# Altium project STM32F207VC.PrjPCB
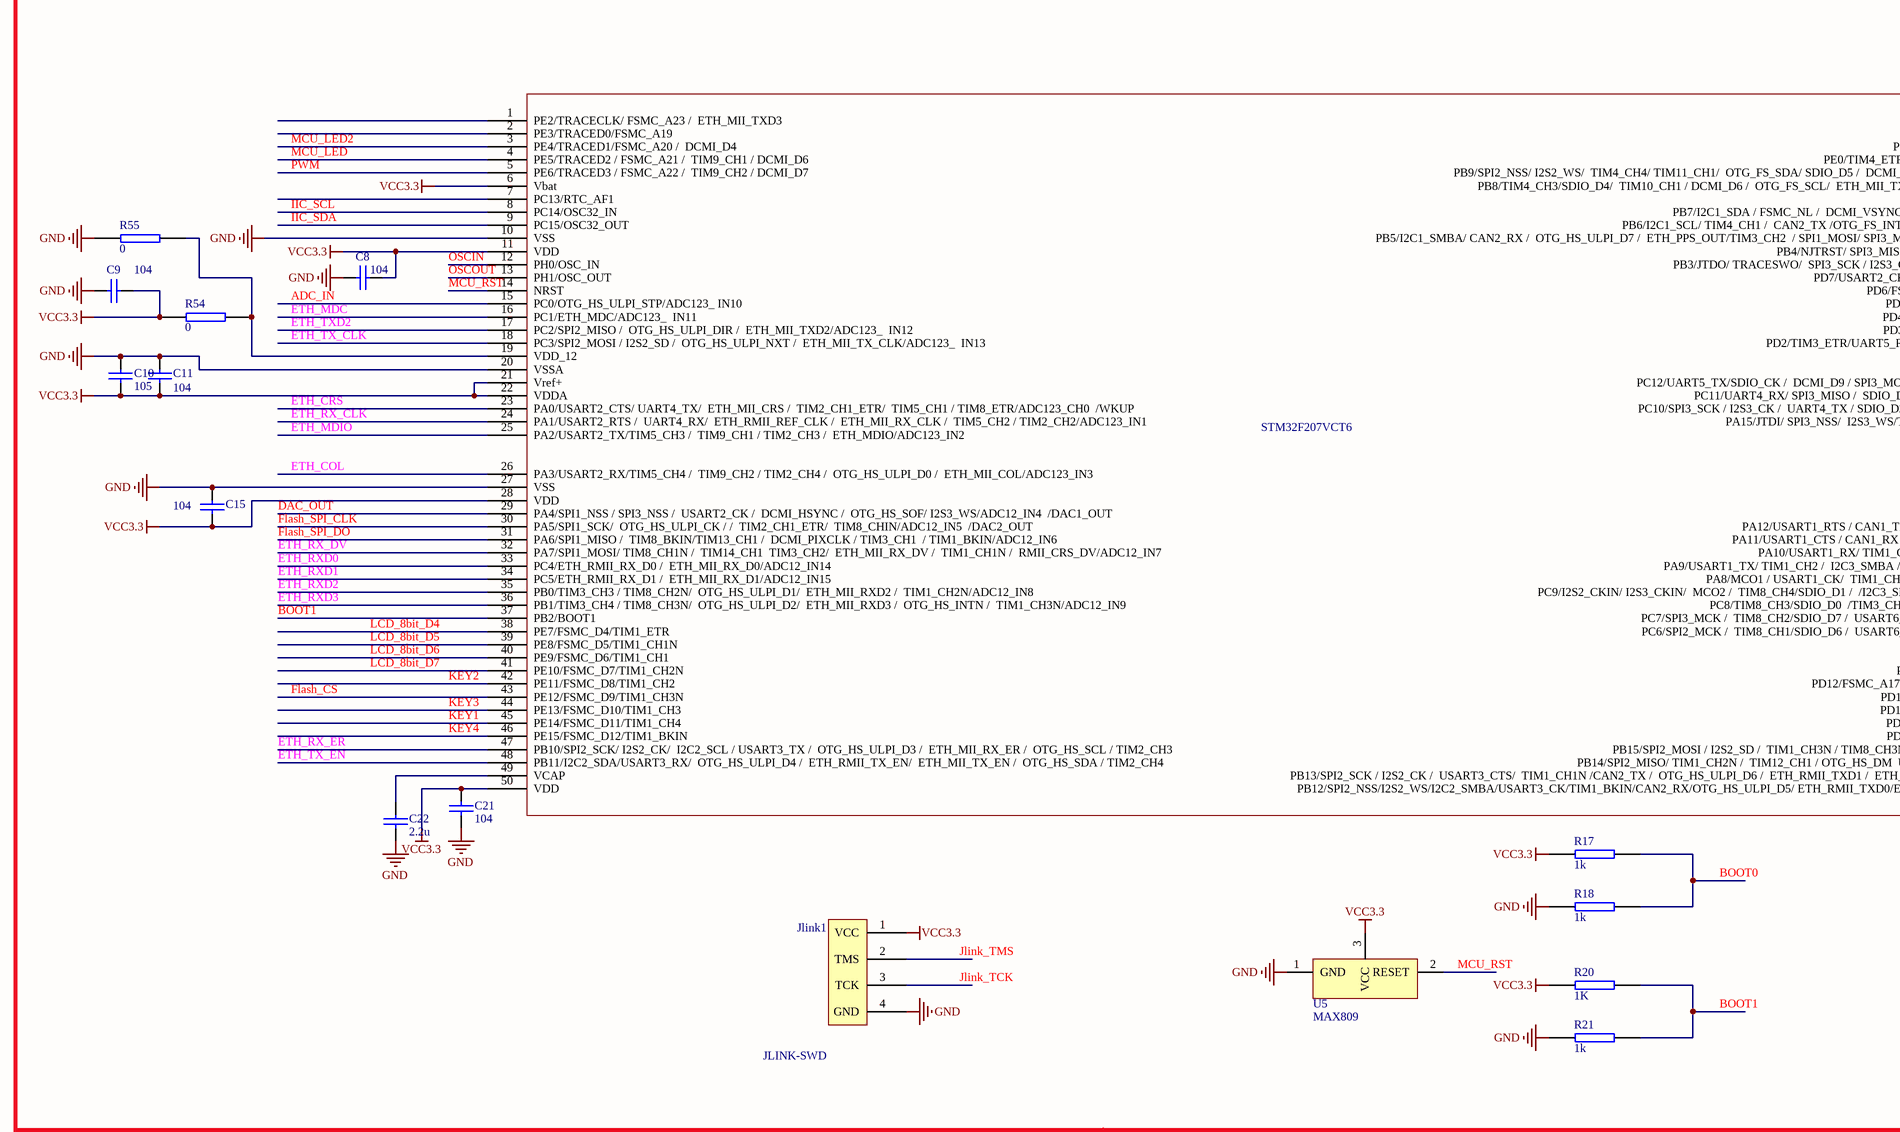
[diagram p0: STM32F207VC.SchDoc, top left]
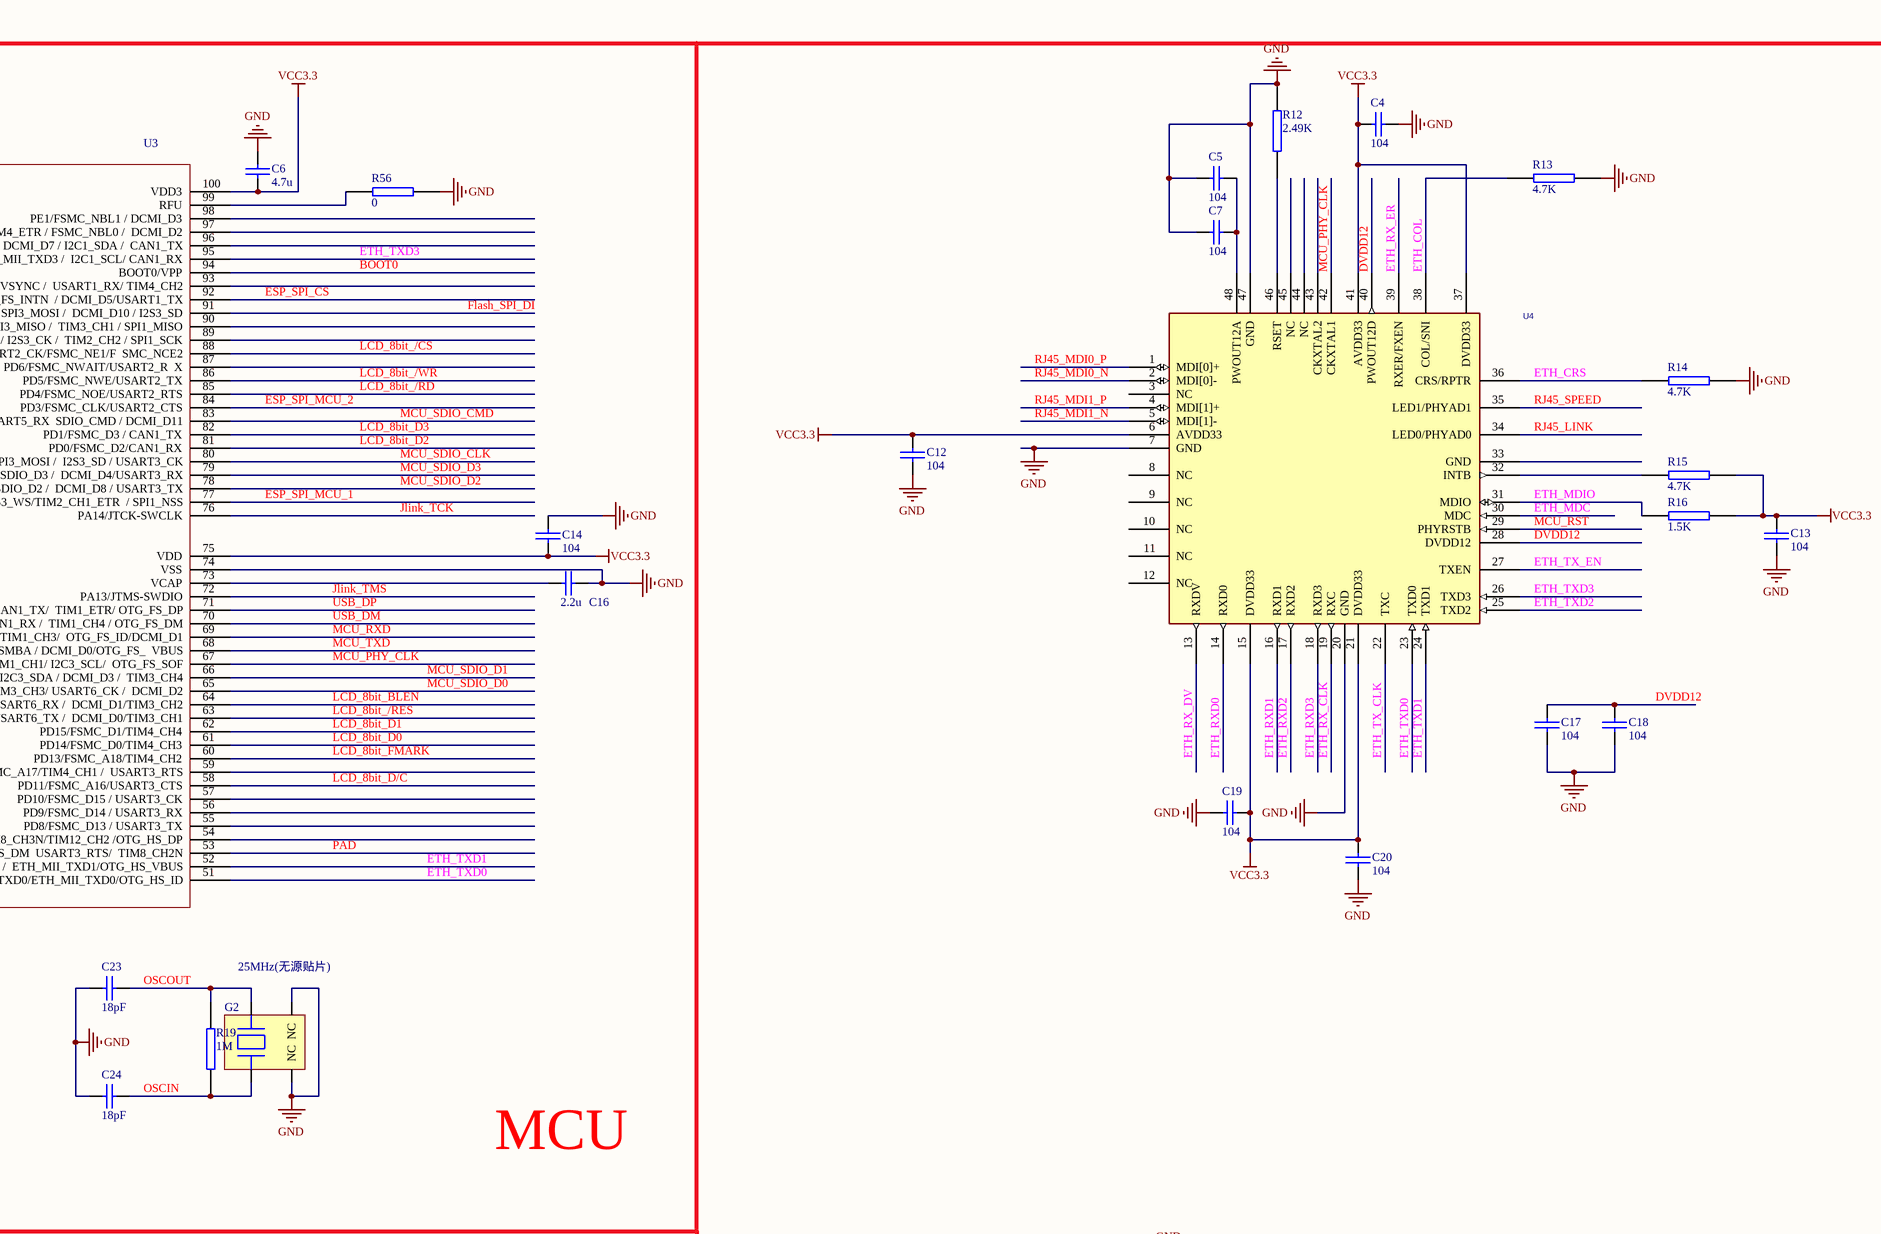
[diagram p1: STM32F207VC.SchDoc, top middle]
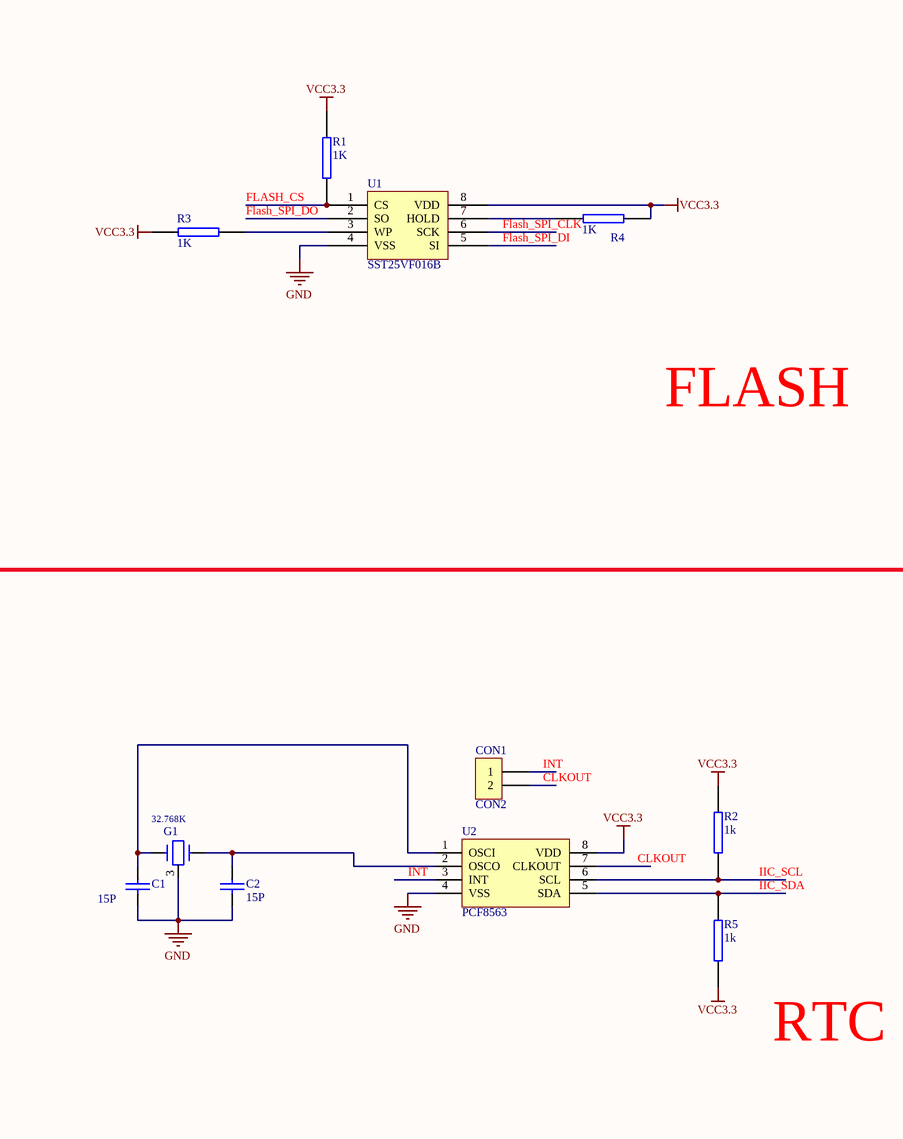
[diagram p2: STM32F207VC.SchDoc, top right]
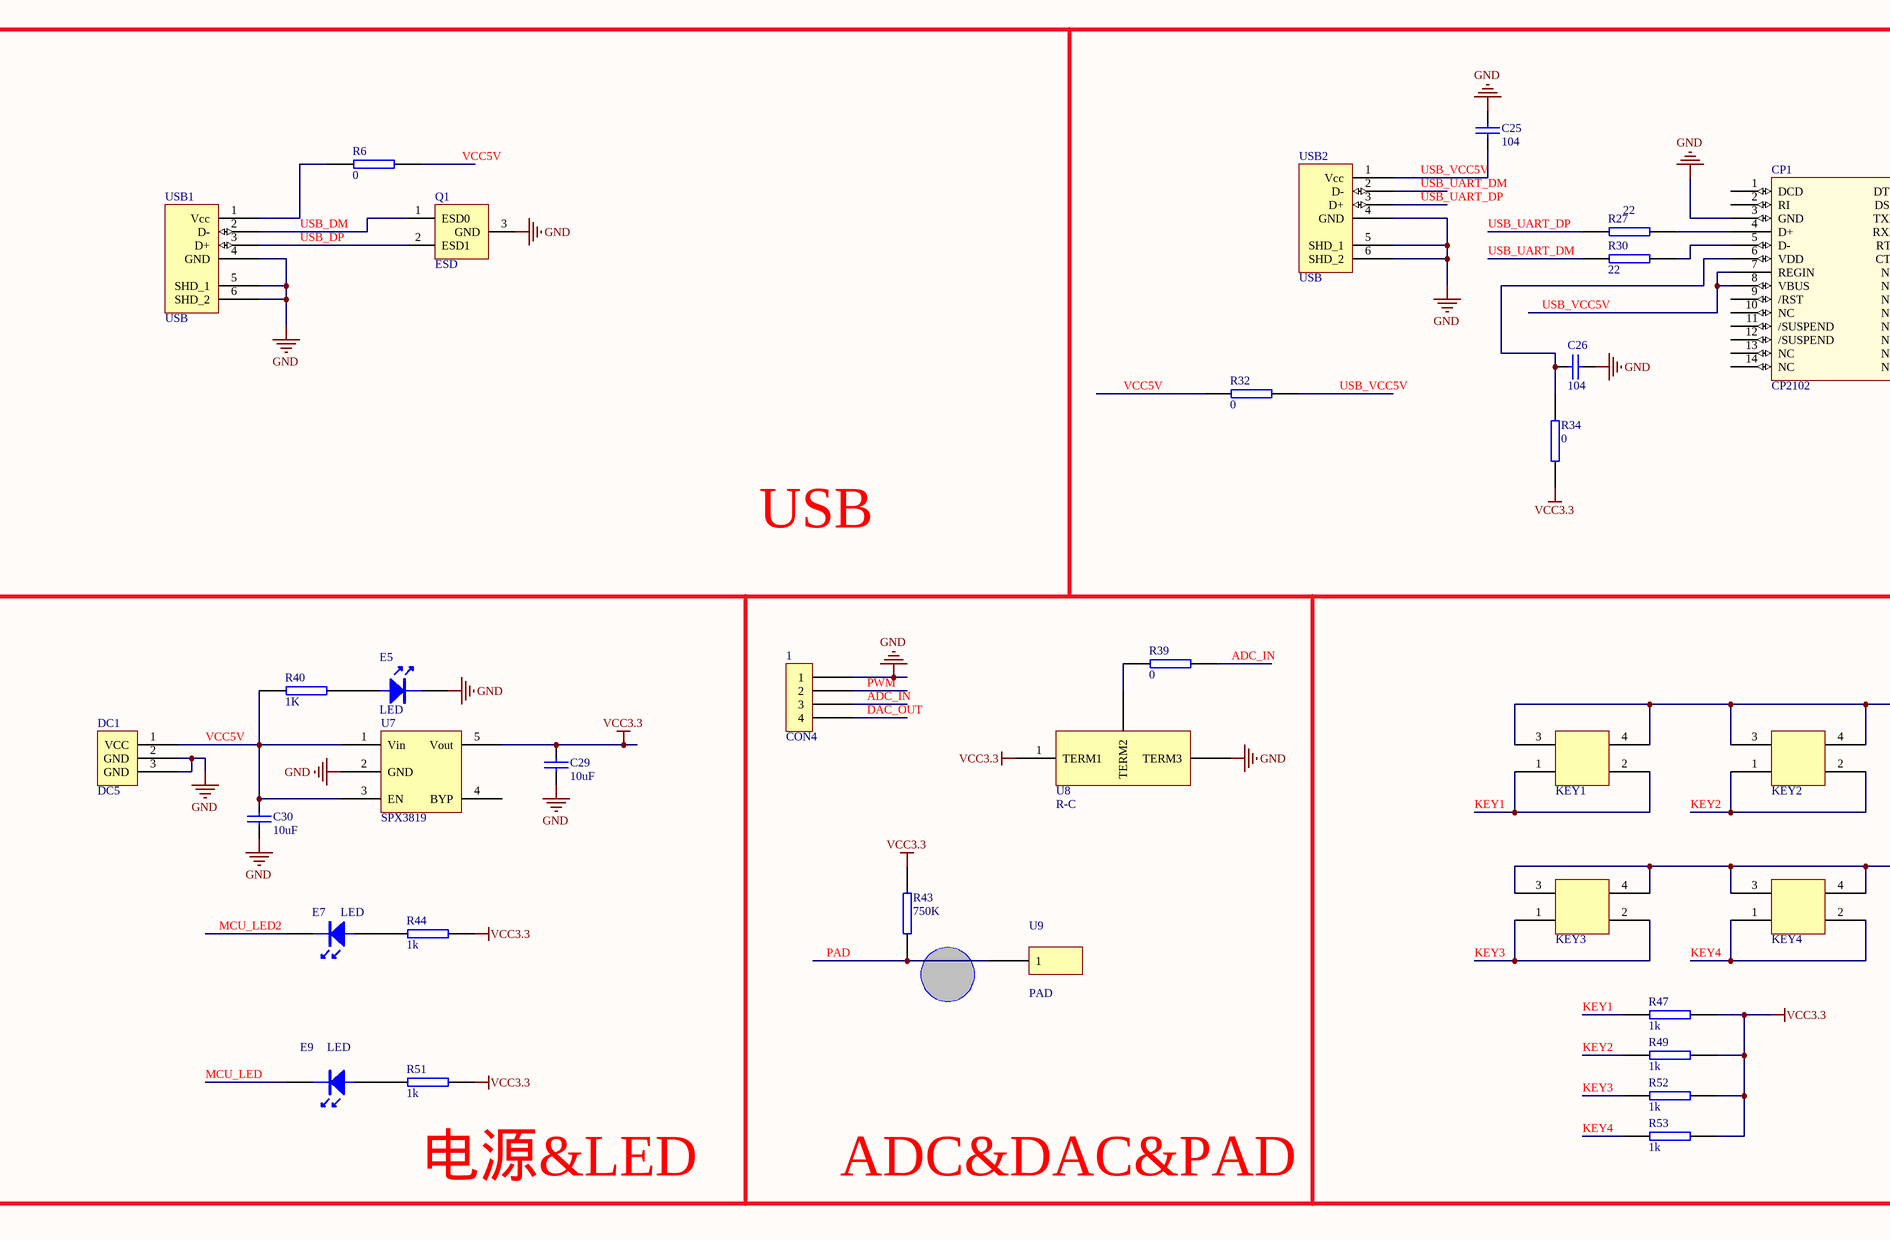
[diagram p3: STM32F207VC.SchDoc, bottom left]
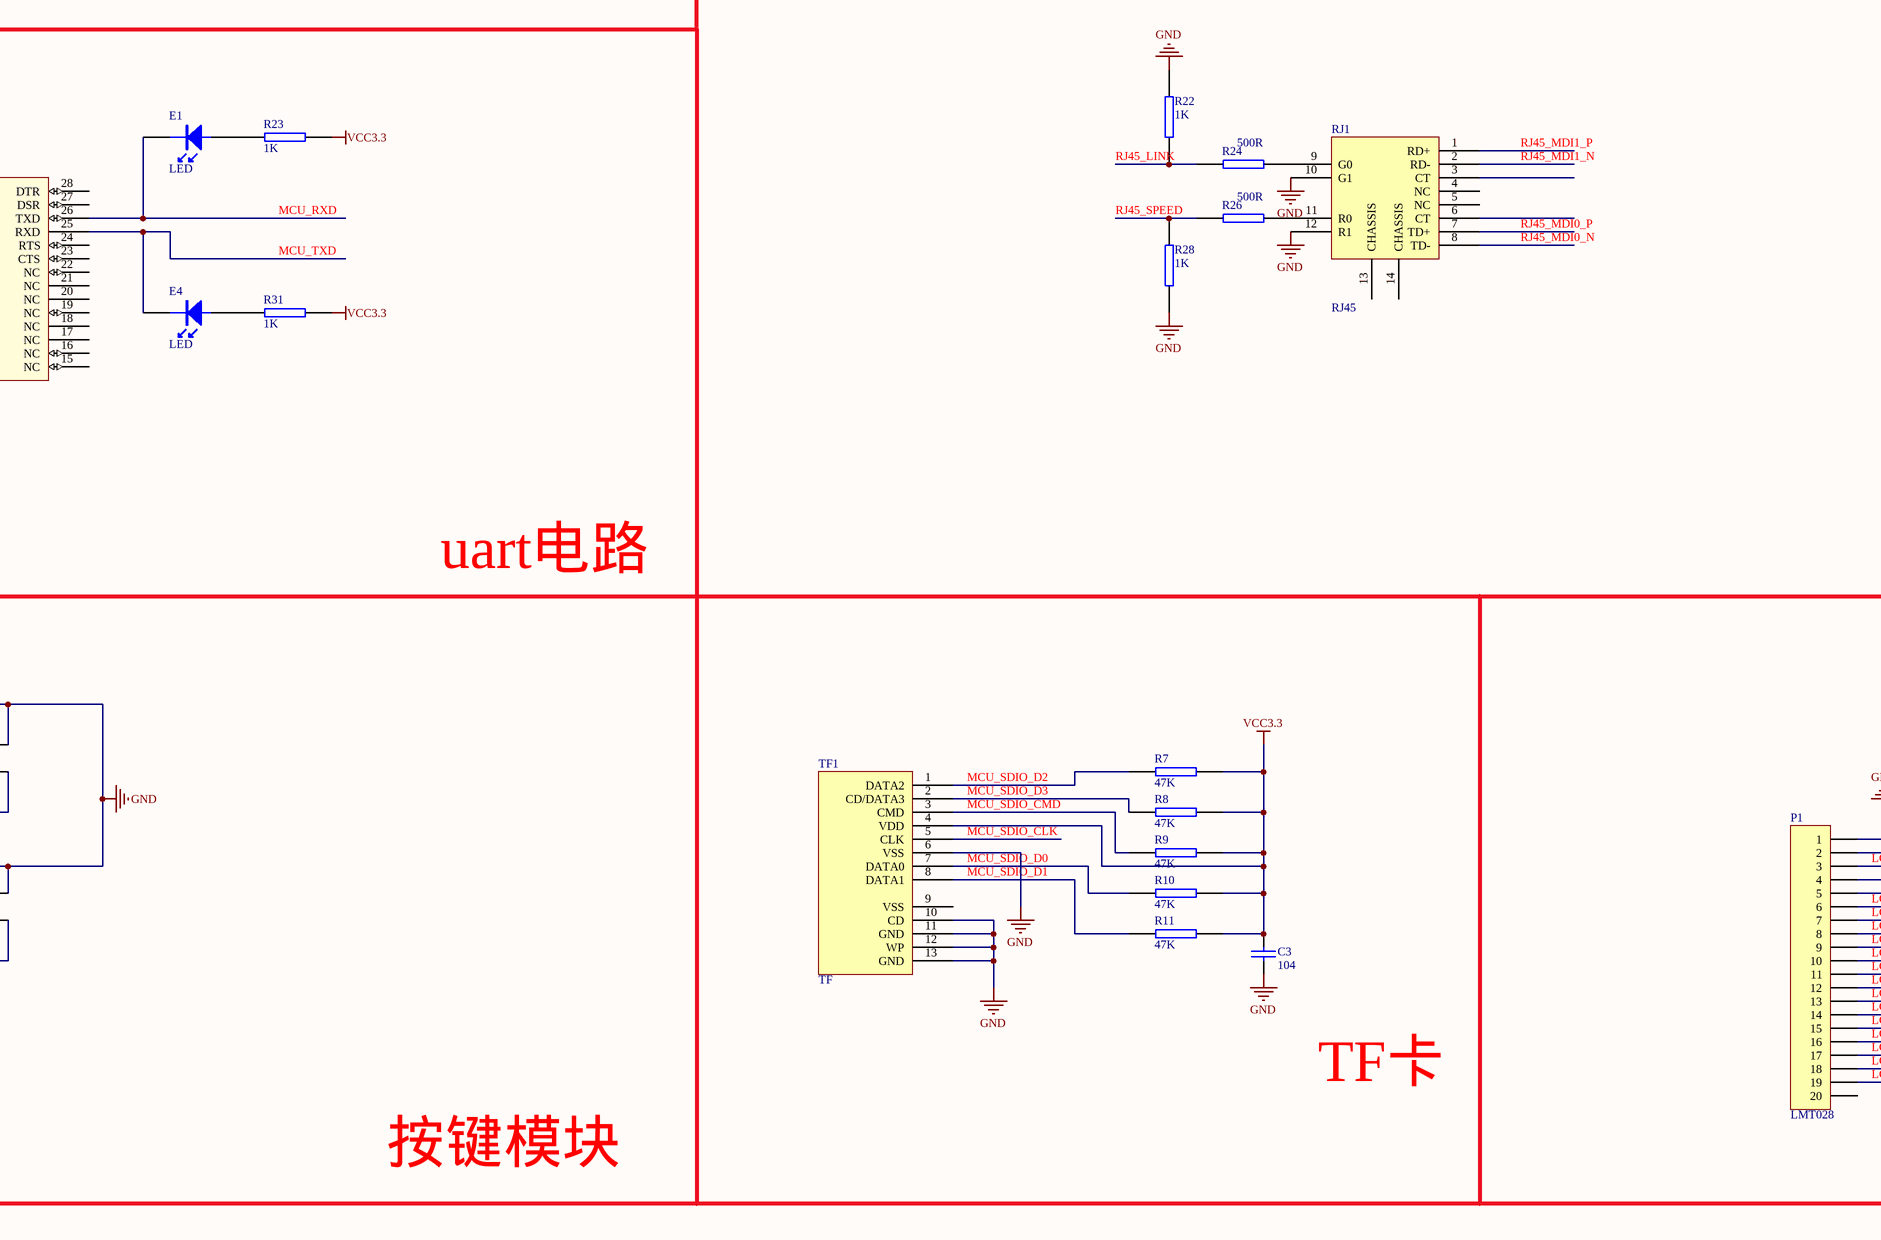
[diagram p4: STM32F207VC.SchDoc, bottom middle]
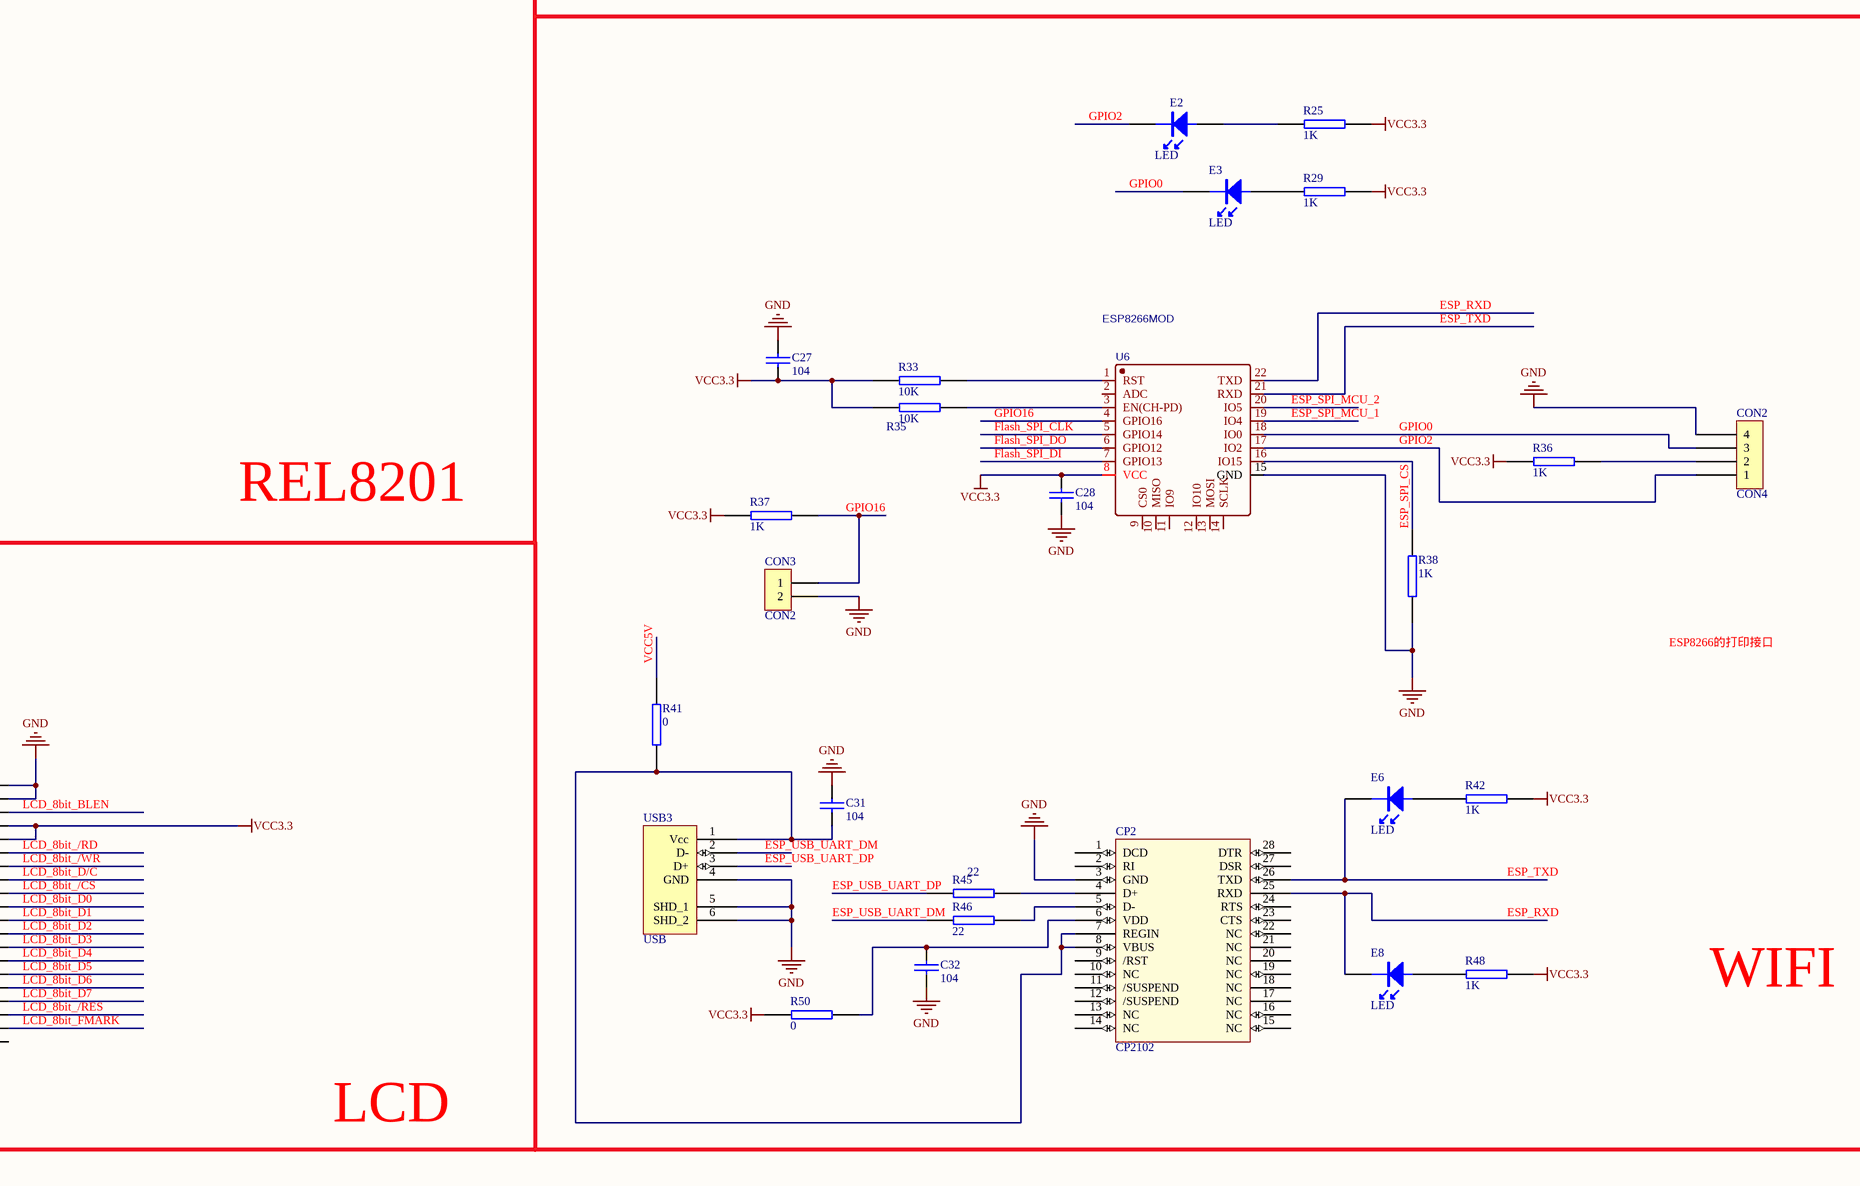
[diagram p5: STM32F207VC.SchDoc, bottom right]
1 sheet, 127 parts. Net scope: global (net labels, ports and power ports of the same name join across sheets).
Board file: STM32F207VC.PcbDoc

## Sheet STM32F207VC.SchDoc
size A0

### Parts
1  CON4  [4 pin]
C1  15P  [0603]
C2  15P  [0603]
C3  104  [0603]
C4  104  [0603]
C5  104  [0603]
C6  4.7u  [0603]
C7  104  [0603]
C8  104  [0603]
C9  104  [0603]
C10  105  [0603]
C11  104  [0603]
C12  104  [0603]
C13  104  [0603]
C14  104  [0603]
C15  104  [0603]
C16  2.2u  [0603]
C17  104  [0603]
C18  104  [0603]
C19  104  [0603]
C20  104  [0603]
C21  104  [0603]
C22  2.2u  [0603]
C23  18pF  [0603]
C24  18pF  [0603]
C25  104  [0603]
C26  104  [0603]
C27  104  [0603]
C28  104  [0603]
C29  10uF  [0603]
C30  10uF  [0603]
C31  104  [0603]
C32  104  [0603]
CON1  CON2  [2pin]
CON2  CON4  [4 pin]
CON3  CON2  [2pin]
CP1  CP2102  [QFN28]
CP2  CP2102  [QFN28]
DC1  DC5  [DC5]
E1  LED  [LED_0603L]
E2  LED  [LED_0603L]
E3  LED  [LED_0603L]
E4  LED  [LED_0603L]
E5  LED  [LED_0603L]
E6  LED  [LED_0603L]
E7  LED  [LED_0603L]
E8  LED  [LED_0603L]
E9  LED  [LED_0603L]
G1  32.768K  [XTAL3X8]
G2  25MHz(无源贴片)  [G3225]
Jlink1  JLINK-SWD  [Jlink-SWD]
KEY1  KEY  [KEY]  (value not drawn)
KEY2  KEY  [KEY]  (value not drawn)
KEY3  KEY  [KEY]  (value not drawn)
KEY4  KEY  [KEY]  (value not drawn)
P1  LMT028  [2.0 pin]
Q1  ESD  [SOT32-809]
R1  1K  [0603]
R2  1k  [0603]
R3  1K  [0603]
R4  1K  [0603]
R5  1k  [0603]
R6  0  [0603]
R7  47K  [0603]
R8  47K  [0603]
R9  47K  [0603]
R10  47K  [0603]
R11  47K  [0603]
R12  2.49K  [0603]
R13  4.7K  [0603]
R14  4.7K  [0603]
R15  4.7K  [0603]
R16  1.5K  [0603]
R17  1k  [0603]
R18  1k  [0603]
R19  1M  [0603]
R20  1K  [0603]
R21  1k  [0603]
R22  1K  [0603]
R23  1K  [0603]
R24  500R  [0603]
R25  1K  [0603]
R26  500R  [0603]
R27  22  [0603]
R28  1K  [0603]
R29  1K  [0603]
R30  22  [0603]
R31  1K  [0603]
R32  0  [0603]
R33  10K  [0603]
R34  0  [0603]
R35  10K  [0603]
R36  1K  [0603]
R37  1K  [0603]
R38  1K  [0603]
R39  0  [0603]
R40  1K  [0603]
R41  0  [0603]
R42  1K  [0603]
R43  750K  [0603]
R44  1k  [0603]
R45  22  [0603]
R46  22  [0603]
R47  1k  [0603]
R48  1K  [0603]
R49  1k  [0603]
R50  0  [0603]
R51  1k  [0603]
R52  1k  [0603]
R53  1k  [0603]
R54  0  [0603]
R55  0  [0603]
R56  0  [0603]
RJ1  RJ45  [RJ45]
TF1  TF  [TF]
U1  SST25VF016B  [SOW8]
U2  PCF8563  [SO8]
U3  STM32F207VCT6  [LQFP-100]
U4  RTL8201EL  [RTL8201EL-LQFP48]  (value not drawn)
U5  MAX809  [SOT32-809]
U6  ESP8266MOD  [ESP8266MOD]
U7  SPX3819  [SOT-23-5]
U8  R-C  [R-Change]
U9  PAD  [PAD]
USB1  USB  [USB-TA]
USB2  USB  [USB-TB]
USB3  USB  [USB-TB]

### Nets
GND: 1.1 C1.2 C2.2 C3.2 C4.2 C5.1 C6.2 C7.1 C8.1 C9.1 C10.2 C11.2 C12.1 C13.1 C14.2 C15.2 C16.1 C17.1 C18.1 C19.2 C20.1 C21.2 C22.1 C23.1 C24.1 C25.1 C26.2 C27.1 C28.2 C29.2 C30.2 C31.1 C32.2 CON2.4 CON3.2 CP1.3(GND) CP2.3(GND) DC1.2(GND) DC1.3(GND) E5.2 G1.3 G2.2(NC) G2.4(NC) Jlink1.4(GND) KEY1.3 KEY1.4 KEY2.3 KEY2.4 KEY3.3 KEY3.4 KEY4.3 KEY4.4 P1.1 P1.2 Q1.3(GND) R12.1 R13.1 R14.1 R18.1 R21.1 R22.2 R28.1 R38.2 R55.1 R56.2 RJ1.10(G1) RJ1.12(R1) TF1.6(VSS) TF1.10(CD) TF1.11(GND) TF1.12(WP) TF1.13(GND) U1.4(VSS) U2.4(VSS) U3.10(VSS) U3.20(VSSA) U3.27(VSS) U3.74(VSS) U4.7(GND) U4.20(GND) U4.47(GND) U5.1(GND) U6.15(GND) U7.2(GND) U8.3(TERM3) USB1.4(GND) USB1.5(SHD_1) USB1.6(SHD_2) USB2.4(GND) USB2.5(SHD_1) USB2.6(SHD_2) USB3.4(GND) USB3.5(SHD_1) USB3.6(SHD_2)
VCC3.3: C3.1 C4.1 C6.1 C8.2 C9.2 C10.1 C11.1 C12.2 C13.2 C14.1 C15.1 C19.1 C20.2 C21.1 C27.2 C28.1 C29.1 Jlink1.1(VCC) P1.4 P1.5 R1.2 R2.2 R3.1 R4.2 R5.1 R7.2 R8.2 R9.2 R10.2 R11.2 R15.1 R16.1 R17.1 R20.1 R23.2 R25.2 R29.2 R31.2 R33.1 R34.1 R35.1 R36.1 R37.2 R42.2 R43.2 R44.2 R47.2 R48.2 R49.2 R50.2 R51.2 R52.2 R53.2 R54.1 TF1.4(VDD) U1.8(VDD) U2.8(VDD) U3.6(Vbat) U3.11(VDD) U3.21(Vref+) U3.22(VDDA) U3.28(VDD) U3.50(VDD) U3.75(VDD) U3.100(VDD3) U4.6(AVDD33) U4.15(DVDD33) U4.21(DVDD33) U4.37(DVDD33) U4.41(AVDD33) U5.3(VCC) U6.8(VCC) U7.5(Vout) U8.1(TERM1)
ADC_IN: 1.3 R39.2 U3.15(PC0/OTG_HS_ULPI_STP/ADC123__IN10)
BOOT0: R17.2 R18.2 U3.94(BOOT0/VPP)
BOOT1: R20.2 R21.2 U3.37(PB2/BOOT1)
CLKOUT: CON1.2 U2.7(CLKOUT)
DAC_OUT: 1.4 U3.29(PA4/SPI1_NSS_/_SPI3_NSS_/__USART2_CK_/__DCMI_HSYNC_/__OTG_HS_SOF/_I2S3_WS/ADC12_IN4__/DAC1_OUT)
DVDD12: C17.2 C18.2 U4.28(DVDD12) U4.40(PWOUT12D)
ESP_RXD: CP2.25(RXD) E8.2 U6.22(TXD)
ESP_SPI_CS: R38.1 U3.92(PB6/I2C1_SCL/_TIM4_CH1_/__CAN2_TX_/OTG_FS_INTN__/_DCMI_D5/USART1_TX) U6.16(IO15)
ESP_SPI_MCU_1: U3.77(PA15/JTDI/_SPI3_NSS/__I2S3_WS/TIM2_CH1_ETR__/_SPI1_NSS) U6.19(IO4)
ESP_SPI_MCU_2: U3.84(PD3/FSMC_CLK/USART2_CTS) U6.20(IO5)
ESP_TXD: CP2.26(TXD) E6.2 U6.21(RXD)
ESP_USB_UART_DM: R46.1 USB3.2(D-)
ESP_USB_UART_DP: R45.1 USB3.3(D+)
ETH_COL: R13.2 U3.26(PA3/USART2_RX/TIM5_CH4_/__TIM9_CH2_/_TIM2_CH4_/__OTG_HS_ULPI_D0_/__ETH_MII_COL/ADC123_IN3) U4.38(COL/SNI)
ETH_CRS: R14.2 U3.23(PA0/USART2_CTS/_UART4_TX/__ETH_MII_CRS_/__TIM2_CH1_ETR/__TIM5_CH1_/_TIM8_ETR/ADC123_CH0__/WKUP) U4.36(CRS/RPTR)
ETH_MDC: U3.16(PC1/ETH_MDC/ADC123___IN11) U4.30(MDC)
ETH_MDIO: R16.2 U3.25(PA2/USART2_TX/TIM5_CH3_/__TIM9_CH1_/_TIM2_CH3_/__ETH_MDIO/ADC123_IN2) U4.31(MDIO)
ETH_RX_CLK: U3.24(PA1/USART2_RTS_/__UART4_RX/__ETH_RMII_REF_CLK_/__ETH_MII_RX_CLK_/__TIM5_CH2_/_TIM2_CH2/ADC123_IN1) U4.19(RXC)
ETH_RX_DV: U3.32(PA7/SPI1_MOSI/_TIM8_CH1N_/__TIM14_CH1__TIM3_CH2/__ETH_MII_RX_DV_/__TIM1_CH1N_/__RMII_CRS_DV/ADC12_IN7) U4.13(RXDV)
ETH_RX_ER: U3.47(PB10/SPI2_SCK/_I2S2_CK/__I2C2_SCL_/_USART3_TX_/__OTG_HS_ULPI_D3_/__ETH_MII_RX_ER_/__OTG_HS_SCL_/_TIM2_CH3) U4.39(RXER/FXEN)
ETH_RXD0: U3.33(PC4/ETH_RMII_RX_D0_/__ETH_MII_RX_D0/ADC12_IN14) U4.14(RXD0)
ETH_RXD1: U3.34(PC5/ETH_RMII_RX_D1_/__ETH_MII_RX_D1/ADC12_IN15) U4.16(RXD1)
ETH_RXD2: U3.35(PB0/TIM3_CH3_/_TIM8_CH2N/__OTG_HS_ULPI_D1/__ETH_MII_RXD2_/__TIM1_CH2N/ADC12_IN8) U4.17(RXD2)
ETH_RXD3: U3.36(PB1/TIM3_CH4_/_TIM8_CH3N/__OTG_HS_ULPI_D2/__ETH_MII_RXD3_/__OTG_HS_INTN_/__TIM1_CH3N/ADC12_IN9) U4.18(RXD3)
ETH_TX_CLK: U3.18(PC3/SPI2_MOSI_/_I2S2_SD_/__OTG_HS_ULPI_NXT_/__ETH_MII_TX_CLK/ADC123___IN13) U4.22(TXC)
ETH_TX_EN: U3.48(PB11/I2C2_SDA/USART3_RX/__OTG_HS_ULPI_D4_/__ETH_RMII_TX_EN/__ETH_MII_TX_EN_/__OTG_HS_SDA_/_TIM2_CH4) U4.27(TXEN)
ETH_TXD0: U3.51(PB12/SPI2_NSS/I2S2_WS/I2C2_SMBA/USART3_CK/TIM1_BKIN/CAN2_RX/OTG_HS_ULPI_D5/_ETH_RMII_TXD0/ETH_MII_TXD0/OTG_HS_ID) U4.23(TXD0)
ETH_TXD1: U3.52(PB13/SPI2_SCK_/_I2S2_CK_/__USART3_CTS/__TIM1_CH1N_/CAN2_TX_/__OTG_HS_ULPI_D6_/__ETH_RMII_TXD1_/__ETH_MII_TXD1/OTG_HS_VBUS) U4.24(TXD1)
ETH_TXD2: U3.17(PC2/SPI2_MISO_/__OTG_HS_ULPI_DIR_/__ETH_MII_TXD2/ADC123___IN12) U4.25(TXD2)
ETH_TXD3: U3.95(PB8/TIM4_CH3/SDIO_D4/__TIM10_CH1_/_DCMI_D6_/__OTG_FS_SCL/__ETH_MII_TXD3_/__I2C1_SCL/_CAN1_RX) U4.26(TXD3)
Flash_CS: R1.1 U1.1(CS) U3.43(PE12/FSMC_D9/TIM1_CH3N)
Flash_SPI_CLK: U1.6(SCK) U3.30(PA5/SPI1_SCK/__OTG_HS_ULPI_CK_/_/__TIM2_CH1_ETR/__TIM8_CHIN/ADC12_IN5__/DAC2_OUT) U6.5(GPIO14)
Flash_SPI_DI: U1.5(SI) U3.91(PB5/I2C1_SMBA/_CAN2_RX_/__OTG_HS_ULPI_D7_/__ETH_PPS_OUT/TIM3_CH2__/_SPI1_MOSI/_SPI3_MOSI_/__DCMI_D10_/_I2S3_SD) U6.7(GPIO13)
Flash_SPI_DO: U1.2(SO) U3.31(PA6/SPI1_MISO_/__TIM8_BKIN/TIM13_CH1_/__DCMI_PIXCLK_/_TIM3_CH1__/_TIM1_BKIN/ADC12_IN6) U6.6(GPIO12)
GPIO0: CON2.3 E3.2 U6.18(IO0)
GPIO2: CON2.1 E2.2 U6.17(IO2)
GPIO16: CON3.1 R37.1 U6.4(GPIO16)
IIC_SCL: R2.1 U2.6(SCL) U3.8(PC14/OSC32_IN)
IIC_SDA: R5.2 U2.5(SDA) U3.9(PC15/OSC32_OUT)
INT: CON1.1 U2.3(INT)
Jlink_TCK: Jlink1.3(TCK) U3.76(PA14/JTCK-SWCLK)
Jlink_TMS: Jlink1.2(TMS) U3.72(PA13/JTMS-SWDIO)
KEY1: KEY1.1 KEY1.2 R47.1 U3.45(PE14/FSMC_D11/TIM1_CH4)
KEY2: KEY2.1 KEY2.2 R49.1 U3.42(PE11/FSMC_D8/TIM1_CH2)
KEY3: KEY3.1 KEY3.2 R52.1 U3.44(PE13/FSMC_D10/TIM1_CH3)
KEY4: KEY4.1 KEY4.2 R53.1 U3.46(PE15/FSMC_D12/TIM1_BKIN)
LCD_8bit_/CS: P1.9 U3.88(PD7/USART2_CK/FSMC_NE1/F__SMC_NCE2)
LCD_8bit_/RD: P1.6 U3.85(PD4/FSMC_NOE/USART2_RTS)
LCD_8bit_/RES: P1.18 U3.63(PC6/SPI2_MCK_/__TIM8_CH1/SDIO_D6_/__USART6_TX_/__DCMI_D0/TIM3_CH1)
LCD_8bit_/WR: P1.7 U3.86(PD5/FSMC_NWE/USART2_TX)
LCD_8bit_BLEN: P1.3 U3.64(PC7/SPI3_MCK_/__TIM8_CH2/SDIO_D7_/__USART6_RX_/__DCMI_D1/TIM3_CH2)
LCD_8bit_D0: P1.10 U3.61(PD14/FSMC_D0/TIM4_CH3)
LCD_8bit_D1: P1.11 U3.62(PD15/FSMC_D1/TIM4_CH4)
LCD_8bit_D2: P1.12 U3.81(PD0/FSMC_D2/CAN1_RX)
LCD_8bit_D3: P1.13 U3.82(PD1/FSMC_D3_/_CAN1_TX)
LCD_8bit_D4: P1.14 U3.38(PE7/FSMC_D4/TIM1_ETR)
LCD_8bit_D5: P1.15 U3.39(PE8/FSMC_D5/TIM1_CH1N)
LCD_8bit_D6: P1.16 U3.40(PE9/FSMC_D6/TIM1_CH1)
LCD_8bit_D7: P1.17 U3.41(PE10/FSMC_D7/TIM1_CH2N)
LCD_8bit_D/C: P1.8 U3.58(PD11/FSMC_A16/USART3_CTS)
LCD_8bit_FMARK: P1.19 U3.60(PD13/FSMC_A18/TIM4_CH2)
MCU_LED: E9.2 U3.4(PE5/TRACED2_/_FSMC_A21_/__TIM9_CH1_/_DCMI_D6)
MCU_LED2: E7.2 U3.3(PE4/TRACED1/FSMC_A20_/__DCMI_D4)
MCU_PHY_CLK: U3.67(PA8/MCO1_/_USART1_CK/__TIM1_CH1/_I2C3_SCL/__OTG_FS_SOF) U4.42(CKXTAL1)
MCU_RST: U3.14(NRST) U4.29(PHYRSTB) U5.2(RESET)
MCU_RXD: CP1.26(TXD) E1.2 U3.69(PA10/USART1_RX/_TIM1_CH3/__OTG_FS_ID/DCMI_D1)
MCU_SDIO_CLK: TF1.5(CLK) U3.80(PC12/UART5_TX/SDIO_CK_/__DCMI_D9_/_SPI3_MOSI_/__I2S3_SD_/_USART3_CK)
MCU_SDIO_CMD: R9.1 TF1.3(CMD) U3.83(PD2/TIM3_ETR/UART5_RX__SDIO_CMD_/_DCMI_D11)
MCU_SDIO_D0: R10.1 TF1.7(DATA0) U3.65(PC8/TIM8_CH3/SDIO_D0__/TIM3_CH3/_USART6_CK_/__DCMI_D2)
MCU_SDIO_D1: R11.1 TF1.8(DATA1) U3.66(PC9/I2S2_CKIN/_I2S3_CKIN/__MCO2_/__TIM8_CH4/SDIO_D1_/__/I2C3_SDA_/_DCMI_D3_/__TIM3_CH4)
MCU_SDIO_D2: R7.1 TF1.1(DATA2) U3.78(PC10/SPI3_SCK_/_I2S3_CK_/__UART4_TX_/_SDIO_D2_/__DCMI_D8_/_USART3_TX)
MCU_SDIO_D3: R8.1 TF1.2(CD/DATA3) U3.79(PC11/UART4_RX/_SPI3_MISO_/__SDIO_D3_/__DCMI_D4/USART3_RX)
MCU_TXD: CP1.25(RXD) E4.2 U3.68(PA9/USART1_TX/_TIM1_CH2_/__I2C3_SMBA_/_DCMI_D0/OTG_FS___VBUS)
OSCIN: C24.2 G2.1 R19.2 U3.12(PH0/OSC_IN)
OSCOUT: C23.2 G2.3 R19.1 U3.13(PH1/OSC_OUT)
PAD: R43.1 U3.53(PB14/SPI2_MISO/_TIM1_CH2N_/__TIM12_CH1_/_OTG_HS_DM__USART3_RTS/__TIM8_CH2N) U9.1
PWM: 1.2 U3.5(PE6/TRACED3_/_FSMC_A22_/__TIM9_CH2_/_DCMI_D7)
RJ45_LINK: R22.1 R24.1 U4.34(LED0/PHYAD0)
RJ45_MDI0_N: RJ1.8(TD-) U4.2(MDI[0]-)
RJ45_MDI0_P: RJ1.7(TD+) U4.1(MDI[0]+)
RJ45_MDI1_N: RJ1.2(RD-) U4.5(MDI[1]-)
RJ45_MDI1_P: RJ1.1(RD+) U4.4(MDI[1]+)
RJ45_SPEED: R26.1 R28.2 U4.35(LED1/PHYAD1)
USB_DM: Q1.1(ESD0) U3.70(PA11/USART1_CTS_/_CAN1_RX_/__TIM1_CH4_/_OTG_FS_DM) USB1.2(D-)
USB_DP: Q1.2(ESD1) U3.71(PA12/USART1_RTS_/_CAN1_TX/__TIM1_ETR/_OTG_FS_DP) USB1.3(D+)
USB_UART_DM: R30.1 USB2.2(D-)
USB_UART_DP: R27.1 USB2.3(D+)
USB_VCC5V: C25.2 CP1.7(REGIN) CP1.8(VBUS) R32.2 USB2.1(Vcc)
VCC5V: C30.1 DC1.1(VCC) R6.2 R32.1 R40.2 R41.2 U7.1(Vin) U7.3(EN)
NetC1_1: C1.1 G1.2 U2.1(OSCI)
NetC2_1: C2.1 G1.1 U2.2(OSCO)
NetC5_2: C5.2 C7.2 U4.48(PWOUT12A)
NetC16_2: C16.2 U3.73(VCAP)
NetC22_2: C22.2 U3.49(VCAP)
NetC26_1: C26.1 CP1.6(VDD) R34.2
NetC31_2: C31.2 CP2.7(REGIN) CP2.8(VBUS) R41.1 USB3.1(Vcc)
NetC32_1: C32.1 CP2.6(VDD) R50.1
NetCON2_2: CON2.2 R36.2
NetCP1_4: CP1.4(D+) R27.2
NetCP1_5: CP1.5(D-) R30.2
NetCP2_4: CP2.4(D+) R45.2
NetCP2_5: CP2.5(D-) R46.2
NetE1_1: E1.1 R23.1
NetE2_1: E2.1 R25.1
NetE3_1: E3.1 R29.1
NetE4_1: E4.1 R31.1
NetE5_1: E5.1 R40.1
NetE6_1: E6.1 R42.1
NetE7_1: E7.1 R44.1
NetE8_1: E8.1 R48.1
NetE9_1: E9.1 R51.1
NetR3_2: R3.2 U1.3(WP)
NetR4_1: R4.1 U1.7(HOLD)
NetR6_1: R6.1 USB1.1(Vcc)
NetR12_2: R12.2 U4.46(RSET)
NetR15_2: R15.2 U4.32(INTB)
NetR24_2: R24.2 RJ1.9(G0)
NetR26_2: R26.2 RJ1.11(R0)
NetR33_2: R33.2 U6.1(RST)
NetR35_2: R35.2 U6.3(EN(CH-PD))
NetR39_1: R39.1 U8.2(TERM2)
NetR54_2: R54.2 R55.2 U3.19(VDD_12)
NetR56_1: R56.1 U3.99(RFU)

Not connected (* = marked no-connect by the designer): CP1 1(DCD) 2(RI) 9(/RST) 10(NC) 11(/SUSPEND) 12(/SUSPEND) 13(NC) 14(NC) 15(NC) 16(NC) 17(NC) 18(NC) 19(NC) 20(NC) 21(NC) 22(NC) 23(CTS) 24(RTS) 27(DSR) 28(DTR); CP2 1(DCD) 2(RI) 9(/RST) 10(NC) 11(/SUSPEND) 12(/SUSPEND) 13(NC) 14(NC) 15(NC) 16(NC) 17(NC) 18(NC) 19(NC) 20(NC) 21(NC) 22(NC) 23(CTS) 24(RTS) 27(DSR) 28(DTR); P1 20; RJ1 3(CT) 4(NC) 5(NC) 6(CT) 13(CHASSIS) 14(CHASSIS); TF1 9(VSS); U3 1(PE2/TRACECLK/_FSMC_A23_/__ETH_MII_TXD3) 2(PE3/TRACED0/FSMC_A19) 7(PC13/RTC_AF1) 54(PB15/SPI2_MOSI_/_I2S2_SD_/__TIM1_CH3N_/_TIM8_CH3N/TIM12_CH2_/OTG_HS_DP) 55(PD8/FSMC_D13_/_USART3_TX) 56(PD9/FSMC_D14_/_USART3_RX) 57(PD10/FSMC_D15_/_USART3_CK) 59(PD12/FSMC_A17/TIM4_CH1_/__USART3_RTS) 87(PD6/FSMC_NWAIT/USART2_R__X) 89(PB3/JTDO/_TRACESWO/__SPI3_SCK_/_I2S3_CK_/__TIM2_CH2_/_SPI1_SCK) 90(PB4/NJTRST/_SPI3_MISO_/__TIM3_CH1_/_SPI1_MISO) 93(PB7/I2C1_SDA_/_FSMC_NL_/__DCMI_VSYNC_/__USART1_RX/_TIM4_CH2) 96(PB9/SPI2_NSS/_I2S2_WS/__TIM4_CH4/_TIM11_CH1/__OTG_FS_SDA/_SDIO_D5_/__DCMI_D7_/_I2C1_SDA_/__CAN1_TX) 97(PE0/TIM4_ETR_/_FSMC_NBL0_/__DCMI_D2) 98(PE1/FSMC_NBL1_/_DCMI_D3); U4 3(NC) 8(NC) 9(NC) 10(NC) 11(NC) 12(NC) 33(GND) 43(CKXTAL2) 44(NC) 45(NC); U6 2(ADC) 9(CS0) 10(MISO) 11(IO9) 12(IO10) 13(MOSI) 14(SCLK); U7 4(BYP)

### Notes on the sheet
- FLASH
- MCU
- RTC
- USB
- uart电路
- REL8201
- ESP8266的打印接口
- WIFI
- TF卡
- (near R51) 电源&LED
- ADC&DAC&PAD
- 按键模块
- LCD

### Library data of the parts
1 CON2 = CON4: 4 Pin
C1-C5 C7 C12 C13 C17-C20 C25-C32 = CAP Nonpolarity: 无极电容
C6 C8-C11 C14-C16 C21 C22 = CAP: 贴片电容
C23 C24 = CAP: 无极电容
CON1 CON3 = CON2: 2pin
CP1 CP2 = CP2102: usb转usart
E1-E9 = LED: LED灯
G1 = CRYSTAL: RTC晶振
G2 = MM-11B: 无源晶振MCU使用
Jlink1 = JLINK-SWD: SWD下载接口
KEY1-KEY4 = KEY: 四脚按钮
P1 = Header 20: 8位LCD; LatestRevisionDate: 17-Jul-2002; LatestRevisionNote: Re-released for DXP Platform.; Publisher: Altium Limited
Q1 = ESD: PESD1CAN
R1-R56 = R: 电阻
TF1 = TF: TF卡
U1 = SST25VF080B: 串行Flash
U2 = PCF8563: RTC芯片
U3 = STM32F207-1
U5 = MAX809: 复位IC
U6 = ESP8266: BOM_Manufacturer: Ai-Thinker; BOM_Manufacturer Part: ESP-12F(ESP8266MOD); BOM_Supplier: LCSC; BOM_Supplier Part: C82891; spicePre: U
U7 = SPX3819: 稳压器
U8 = R-change: 滑动变阻器
U9 = PAD: 触摸